# Altium project Pulser_Driver.PrjPcb
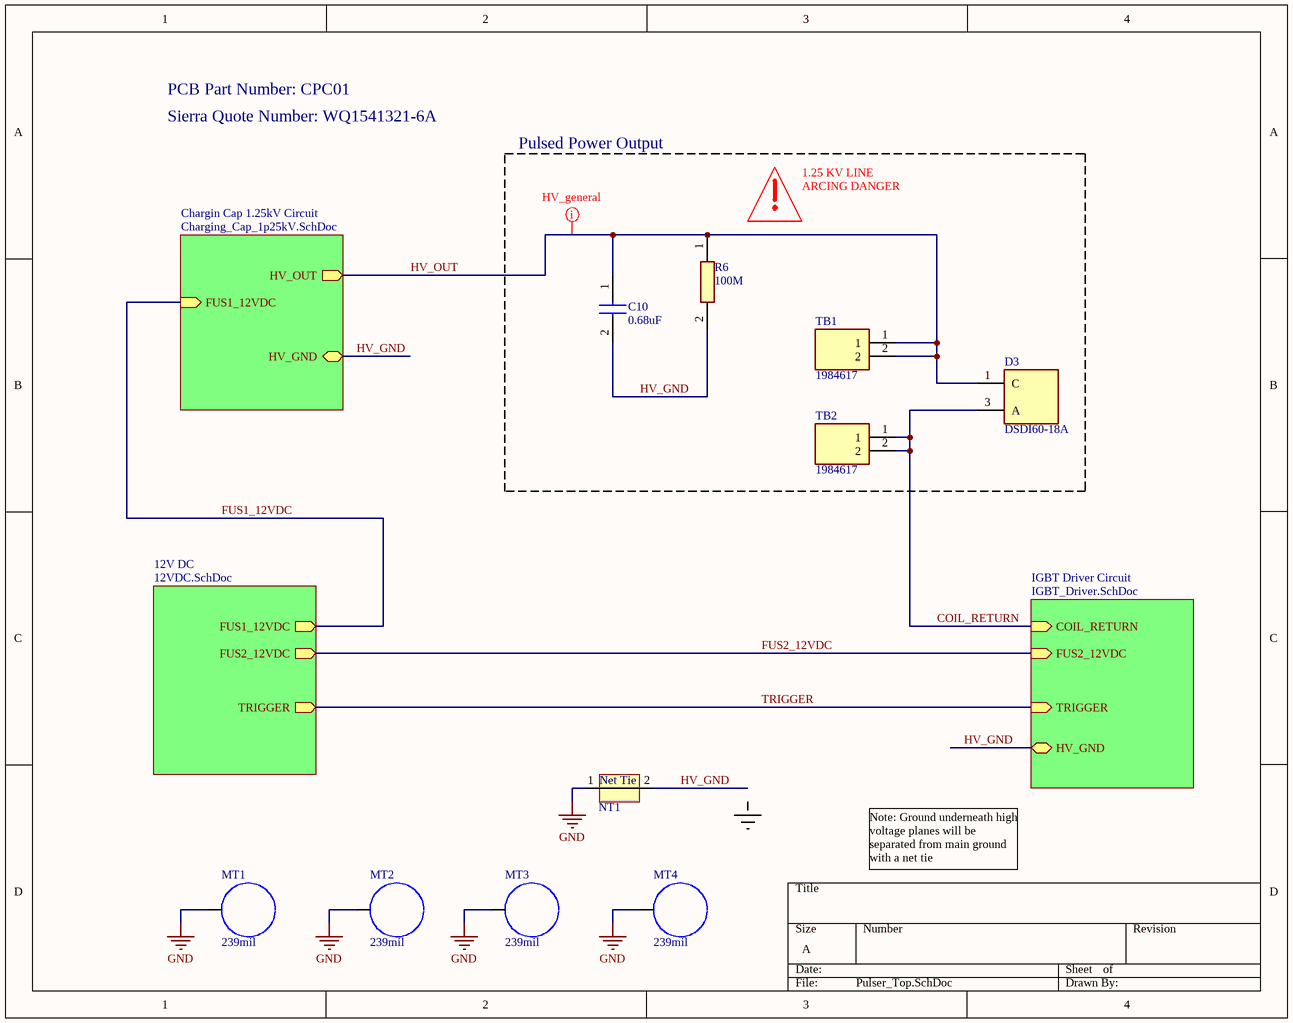
[diagram p0: Pulser_Top.SchDoc]
4 sheets, 49 parts. Net scope: hierarchical (ports join the sheet entries above them; power ports are global).
Board file: Pulser_Driver_PCB.PcbDoc
Sheets:
  Pulser_Top.SchDoc
    Chargin Cap 1.25kV Circuit = Charging_Cap_1p25kV.SchDoc
    12V DC = 12VDC.SchDoc
    IGBT Driver Circuit = IGBT_Driver.SchDoc

## Sheet Pulser_Top.SchDoc
size A; SheetNumber: 1; SheetTotal: 4

### Parts
C10  0.68uF  [MKP1839468134HQ]
D3  DSDI60-18A  [TO546P530X1586X2594-2P]
MT1  239mil  [MTHOLE_239mil]
MT2  239mil  [MTHOLE_239mil]
MT3  239mil  [MTHOLE_239mil]
MT4  239mil  [MTHOLE_239mil]
NT1  Net tie 50mil  [NET_TIE_50mil]  (value not drawn)  (net tie, no BOM)
R6  100M  [HB3100MFZRE]
TB1  1984617  [1984617]
TB2  1984617  [1984617]

### Blocks framed on the sheet
Pulsed Power Output: C10 D3 R6 TB1 TB2

### Sub-sheets
12V DC = 12VDC.SchDoc: TRIGGER (out), FUS2_12VDC (out), FUS1_12VDC (out)
Chargin Cap 1.25kV Circuit = Charging_Cap_1p25kV.SchDoc: HV_OUT (out), FUS1_12VDC (in), HV_GND (bidir)
IGBT Driver Circuit = IGBT_Driver.SchDoc: COIL_RETURN (in), TRIGGER (in), FUS2_12VDC (in), HV_GND (bidir)

### Nets
GND: MT1.1 MT2.1 MT3.1 MT4.1 NT1.1
COIL_RETURN: D3.3(A) TB2.1 TB2.2 ; sheet IGBT Driver Circuit/COIL_RETURN
FUS1_12VDC: sheet Chargin Cap 1.25kV Circuit/FUS1_12VDC, sheet 12V DC/FUS1_12VDC
FUS2_12VDC: sheet 12V DC/FUS2_12VDC, sheet IGBT Driver Circuit/FUS2_12VDC
HV_GND: C10.2 NT1.2 R6.2 ; sheet Chargin Cap 1.25kV Circuit/HV_GND, sheet IGBT Driver Circuit/HV_GND
HV_OUT: C10.1 D3.1(C) R6.1 TB1.1 TB1.2 ; sheet Chargin Cap 1.25kV Circuit/HV_OUT
TRIGGER: sheet 12V DC/TRIGGER, sheet IGBT Driver Circuit/TRIGGER

### Layout directives
net class HV_general: HV_OUT

### Notes on the sheet
- PCB Part Number: CPC01
- Sierra Quote Number: WQ1541321-6A
- 1.25 KV LINE
- ARCING DANGER
- Note: Ground underneath high voltage planes will be separated from main ground with a net tie
- (in symbol NET_TIE_50mil) Net Tie

### Library data of the parts
C10 = MKP1839468134HQ: Capacitor MKP1839468134HQ; Manufacturer_Name: Vishay; Datasheet Link: https://www.vishay.com/docs/28162/mkp1839hq.pdf; Height: 28mm; Manufacturer_Part_Number: MKP1839468134HQ; Mouser Part Number: 75-MKP1839468134HQ; Mouser Price/Stock: https://www.mouser.com/Search/Refine.aspx?Keyword=75-MKP1839468134HQ
D3 = DSDI60-18A: Diode; Manufacturer_Name: LITTELFUSE; Datasheet Link: http://ixapps.ixys.com/DataSheet/96517.pdf; Height: 5.3mm; Manufacturer_Part_Number: DSDI60-18A
MT1-MT4 = MTHOLE_239MIL: Manufacturer Part Number: (NULL); Part Number: MTHOLE_239; Manufacturer: (NULL)
NT1 = NET_TIE_50mil
R6 = HB3100MFZRE: Resistor; Manufacturer_Name: TE Connectivity; Datasheet Link: http://www.te.com/commerce/DocumentDelivery/DDEController?Action=srchrtrv&DocNm=1773310&DocType=DS&DocLang=English; Manufacturer_Part_Number: HB3100MFZRE
TB1 TB2 = 1984617: Connector; Manufacturer_Name: Phoenix Contact; Datasheet Link: https://datasheet.datasheetarchive.com/originals/distributors/Datasheets-DGA17/1074867.pdf; Height: 9.3mm; Manufacturer_Part_Number: 1984617; Mouser Part Number: 651-1984617; Mouser Price/Stock: https://www.mouser.co.uk/ProductDetail/Phoenix-Contact/1984617?qs=ATjOrvm3mOhUrGlJQoUcpQ%3D%3D; Arrow Part Number: 1984617; Arrow Price/Stock: https://www.arrow.com/en/products/1984617/phoenix-contact?region=nac

## Sheet Charging_Cap_1p25kV.SchDoc
size A; SheetNumber: 4; SheetTotal: 4
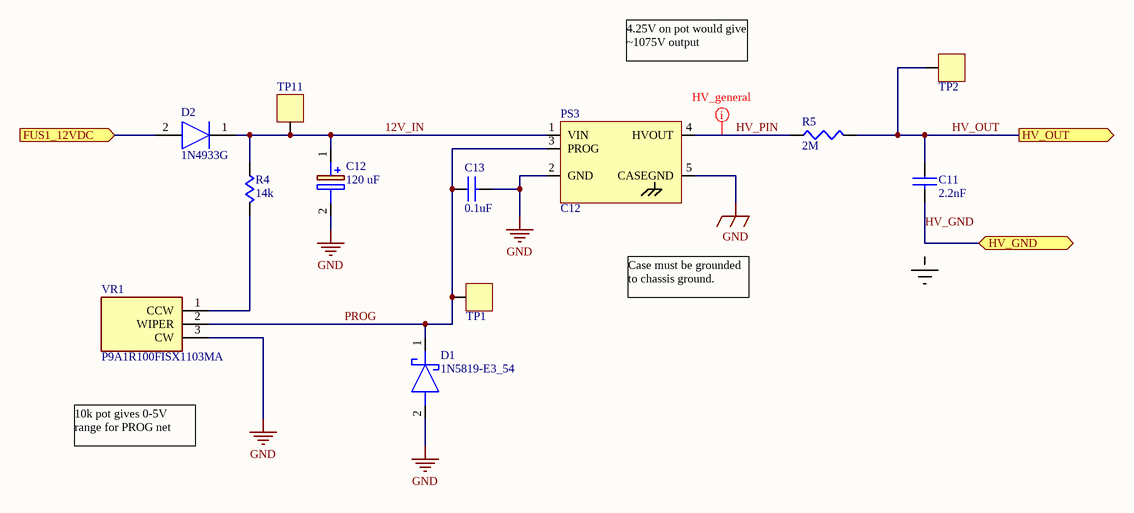
[diagram p1: Charging_Cap_1p25kV.SchDoc]

### Parts
C11  2.2nF  [C331C222KHR5HA]
C12  120 uF  [CAPPRD500W65D1000H1400]
C13  0.1uF  [C420C104K5R5TA7200]
D1  1N5819-E3_54  [DIOAD1405W86L465D235]
D2  1N4933G  [DIOAD1405W86L465D235]
PS3  C12  [C12]
R4  14k  [MFR-25FBF52-14K]
R5  2M  [HHV1WSJT-73-2M]
TP1  5261  [5261]  (value not drawn)
TP2  5261  [5261]  (value not drawn)
TP11  5261  [5261]  (value not drawn)
VR1  P9A1R100FISX1103MA  [P9A1R100FISX1103MA]

### Ports
FUS1_12VDC (in), HV_GND (bidir), HV_OUT (out)

### Nets
GND: C12.2(-) C13.2 D1.2(A) PS3.2(GND) PS3.5(CASEGND) VR1.3(CW)
12V_IN: C12.1(+) D2.1(K) PS3.1(VIN) R4.1 TP11.1
FUS1_12VDC: D2.2(A) ; port FUS1_12VDC
HV_GND: C11.2 ; port HV_GND
HV_OUT: C11.1 R5.2 TP2.1 ; port HV_OUT
HV_PIN: PS3.4(HVOUT) R5.1
PROG: C13.1 D1.1(K) PS3.3(PROG) TP1.1 VR1.2(WIPER)
NetR4_2: R4.2 VR1.1(CCW)

### Layout directives
net class HV_general: HV_PIN

### Notes on the sheet
- 4.25V on pot would give ~1075V output
- Case must be grounded to chassis ground.
- 10k pot gives 0-5V range for PROG net

### Library data of the parts
C11 = C331C222KHR5HA: Multilayer Ceramic Capacitors MLCC - Leaded 3000V 2200pF X7R 10% LS=6.35mm
C12 = EEU-TP1V121: Capacitor Polarised; Manufacturer_Name: Panasonic; Datasheet Link: http://industrial.panasonic.com/cdbs/www-data/pdf/RDF0000/ABA0000C1134.pdf; Height: 14mm; Manufacturer_Part_Number: EEU-TP1V121
C13 = C420C104K5R5TA7200: CAP CER TH 0.1UF 50V X7R AXIAL
D1 = 1N5819-E3_54: Schottky Diode; Manufacturer_Name: Vishay; Manufacturer_Part_Number: 1N5819-E3/54; Datasheet Link: https://www.vishay.com/docs/88525/1n5817.pdf; Mouser Part Number: 625-1N5819-E3; Mouser Price/Stock: https://www.mouser.co.uk/ProductDetail/Vishay-General-Semiconductor/1N5819-E3-54?qs=7w0fSgRKp93guDuu%252B5hJ0Q%3D%3D
D2 = 1N4933G: Rectifiers 50V 1A Fast; Manufacturer_Name: ON Semiconductor; Datasheet Link: https://www.arrow.com/en/products/1n4933g/on-semiconductor; Manufacturer_Part_Number: 1N4933G; Mouser Part Number: 863-1N4933G; Mouser Price/Stock: https://www.mouser.co.uk/ProductDetail/onsemi/1N4933G?qs=y2kkmE52mdNCdpmhcWNRQA%3D%3D; Arrow Part Number: 1N4933G; Arrow Price/Stock: https://www.arrow.com/en/products/1n4933g/on-semiconductor?region=nac
PS3 = C12: MPN is C12, DC DC conv
R4 = MFR-25FBF52-14K: RES TH 14K OHM 1% 1/4W AXIAL
R5 = HHV1WSJT-73-2M: RES 2M OHM 5% 1W AXIAL
TP1 TP2 TP11 = 5261: TEST POINT grabber (BLACK) - MINIATURE
VR1 = P9A1R100FISX1103MA: Variable Resistor 10K; Manufacturer_Name: Vishay; Datasheet Link: https://www.mouser.com/datasheet/2/427/p9-1763422.pdf; Height: 11.35mm; Manufacturer_Part_Number: P9A1R100FISX1103MA; Mouser Part Number: 72-P9A1RFISX1BB2103M; Mouser Price/Stock: https://www.mouser.com/Search/Refine.aspx?Keyword=72-P9A1RFISX1BB2103M

## Sheet 12VDC.SchDoc
size A; SheetNumber: 3; SheetTotal: 4
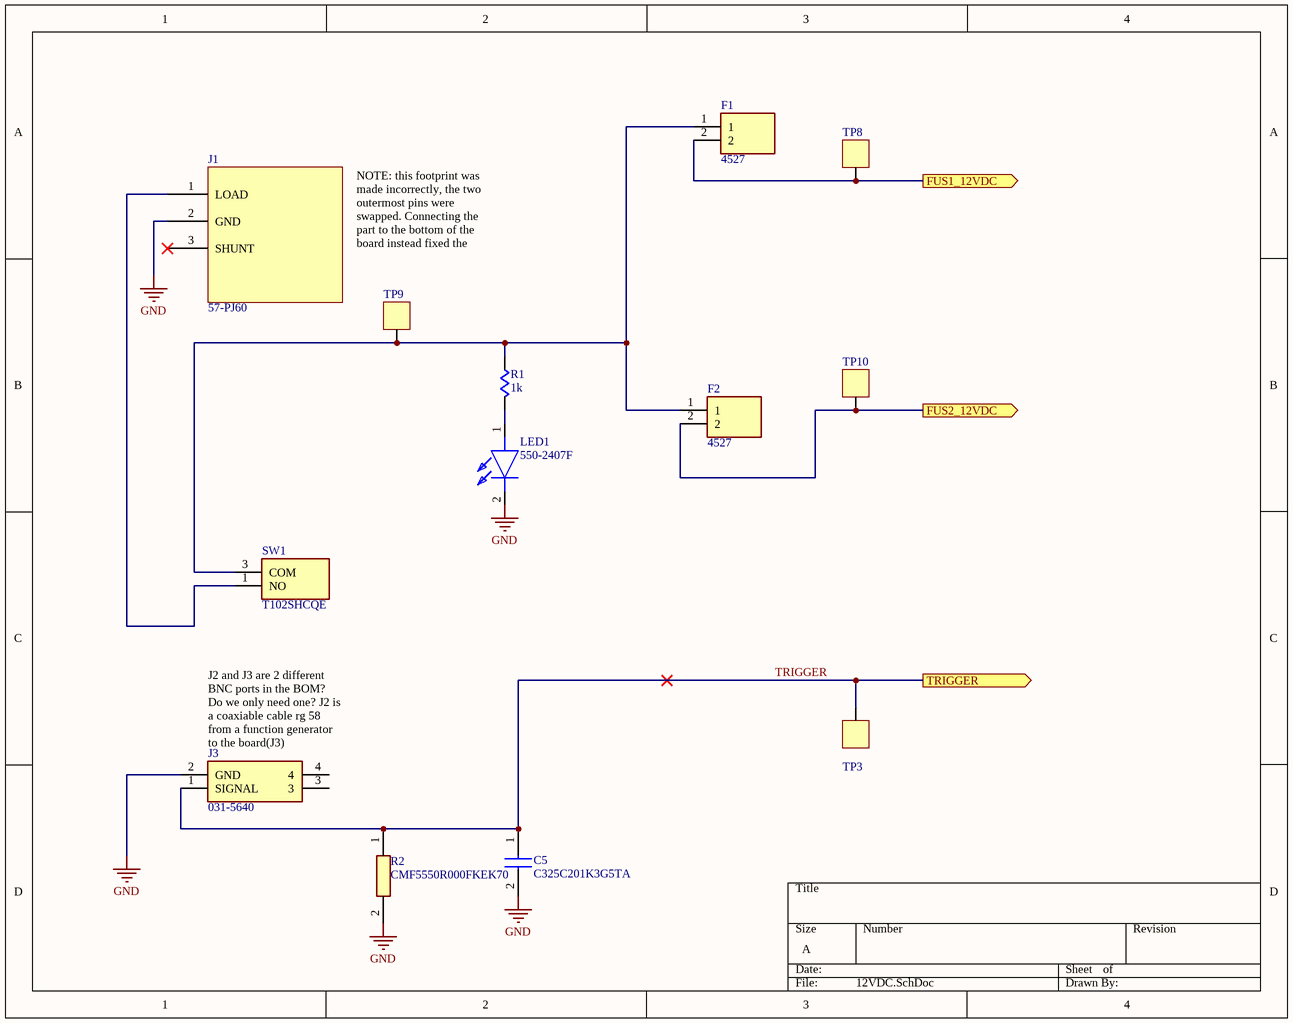
[diagram p2: 12VDC.SchDoc]

### Parts
C5  C325C201K3G5TA  [C325C201K3G5TA]
F1  4527  [4527]
F2  4527  [4527]
J1  57-PJ60  [57-PJ60]
J3  031-5640  [031-5640]
LED1  550-2407F  [5502407F]
R1  1k  [CMF551K0000FKR6]
R2  CMF5550R000FKEK70  [RESAD1526W69L610D229]
SW1  T102SHCQE  [T102SHCQE]
TP3  5261  [5261]  (value not drawn)
TP8  5261  [5261]  (value not drawn)
TP9  5261  [5261]  (value not drawn)
TP10  5261  [5261]  (value not drawn)

### Ports
FUS1_12VDC (out), FUS2_12VDC (out), TRIGGER (out)

### Nets
GND: C5.2 J1.2(GND) J3.2(GND) LED1.2(K) R2.2
FUS1_12VDC: F1.2 TP8.1 ; port FUS1_12VDC
FUS2_12VDC: F2.2 TP10.1 ; port FUS2_12VDC
TRIGGER: C5.1 J3.1(SIGNAL) R2.1 TP3.1 ; port TRIGGER
NetF1_1: F1.1 F2.1 R1.1 SW1.3(COM) TP9.1
NetJ1_1: J1.1(LOAD) SW1.1(NO)
NetLED1_1: LED1.1(A) R1.2

Not connected (* = marked no-connect by the designer): J1 3(SHUNT)*; J3 3 4

### Notes on the sheet
- NOTE: this footprint was made incorrectly, the two outermost pins were swapped. Connecting the part to the bottom of the board instead fixed the issue in hardware.
- (near J3) J2 and J3 are 2 different BNC ports in the BOM? Do we only need one? J2 is a coaxiable cable rg 58 from a function generator to the board(J3)

### Library data of the parts
C5 = C325C201K3G5TA: Capacitor 200 pF; Manufacturer_Name: Kemet; Datasheet Link: https://www.kemet.com/specsheet/C325C201K3G5TA; Height: 7.62mm; Manufacturer_Part_Number: C325C201K3G5TA
F1 F2 = 4527: Undefined or Miscellaneous; Manufacturer_Name: Keystone Electronics; Datasheet Link: https://componentsearchengine.com//4527.pdf; Mouser2 Part Number: 534-4527; Mouser2 Price/Stock: https://www.mouser.com/Search/Refine.aspx?Keyword=534-4527; Manufacturer_Part_Number: 4527
J3 = 031-5640: Connector; Manufacturer_Name: Amphenol; Manufacturer_Part_Number: 031-5640-1010; Datasheet Link: https://datasheet.datasheetarchive.com/originals/distributors/Datasheets_SAMA/570beec7961c44031375f59c7939d09c.pdf; Height: 15.9mm
LED1 = 550-2407F: LED; Manufacturer_Name: Dialight; Datasheet Link: https://componentsearchengine.com//550-2407F.pdf; Height: 6.1mm; Mouser2 Part Number: 645-550-2407F; Mouser2 Price/Stock: https://www.mouser.com/Search/Refine.aspx?Keyword=645-550-2407F; Manufacturer_Part_Number: 550-2407F
R1 = CMF551K0000FKR6: Metal Film Resistors - Through Hole 1/2W 1Kohms 1%
R2 = CMF5550R000FKEK70: Resistor 50ohm; Manufacturer_Name: Vishay; Datasheet Link: http://www.vishay.com/docs/31018/cmfind.pdf; Manufacturer_Part_Number: CMF5550R000FKEK70
SW1 = T102SHCQE: Switch; Manufacturer_Name: C & K COMPONENTS; Datasheet Link: https://componentsearchengine.com/Datasheets/1/T102SHCQE.pdf; Height: 23.56mm; Manufacturer_Part_Number: T102SHCQE
TP3 TP8-TP10 = 5261: TEST POINT grabber (BLACK) - MINIATURE

## Sheet IGBT_Driver.SchDoc
size A; SheetNumber: 2; SheetTotal: 4
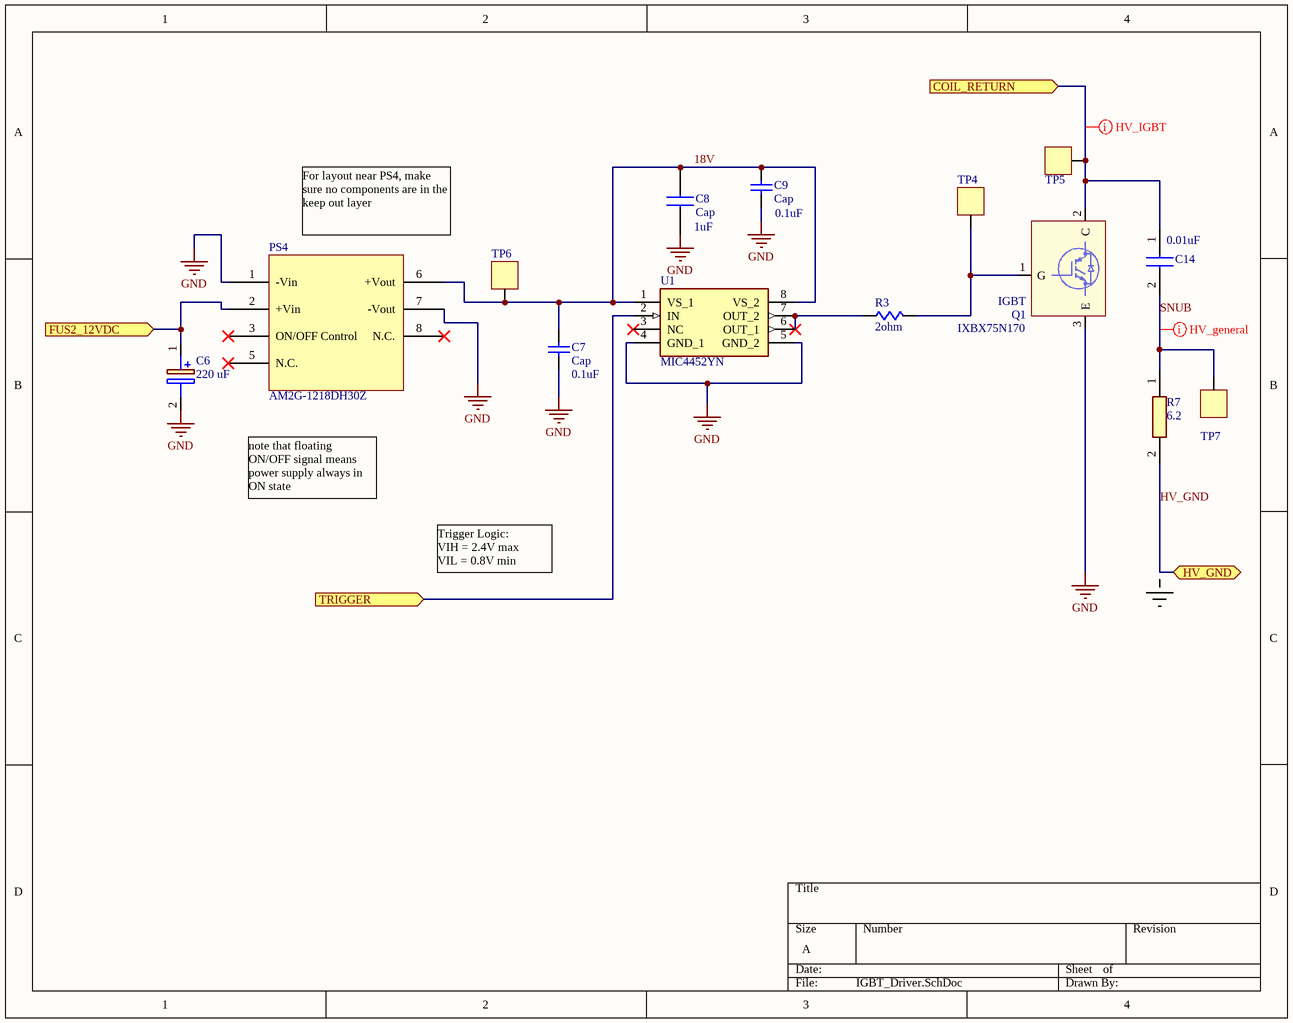
[diagram p3: IGBT_Driver.SchDoc]

### Parts
C6  220 uF  [CAPPRD750W85D1600H2700]
C7  Cap  value 0.1uF  [RAD-0.3]
C8  Cap  [MKS2D041001K00KSSD]
C9  Cap  value 0.1uF  [RAD-0.3]
C14  0.01uF  [FKP1U021006B00MSC9]
PS4  AM2G-1218DH30Z  [AM2G-1218DH30Z]
Q1  IXBX75N170  [TO545P521X1594X2566-3P]
R3  2ohm  [F2W2D0]
R7  6.2  [RESAD1700W60L700D250]
TP4  5261  [5261]  (value not drawn)
TP5  5261  [5261]  (value not drawn)
TP6  5261  [5261]  (value not drawn)
TP7  5261  [5261]  (value not drawn)
U1  MIC4452YN  [DIP762W57P254L952H343Q8N]

### Ports
COIL_RETURN (in), FUS2_12VDC (in), HV_GND (bidir), TRIGGER (in)

### Nets
GND: C6.2(-) C7.1 C8.2 C9.1 PS4.1(-Vin) PS4.7(-Vout) Q1.3(E) U1.4(GND_1) U1.5(GND_2)
18V: C7.2 C8.1 C9.2 PS4.6(+Vout) TP6.1 U1.1(VS_1) U1.8(VS_2)
COIL_RETURN: C14.1 Q1.2(C) TP5.1 ; port COIL_RETURN
FUS2_12VDC: C6.1(+) PS4.2(+Vin) ; port FUS2_12VDC
HV_GND: R7.2 ; port HV_GND
SNUB: C14.2 R7.1 TP7.1
TRIGGER: U1.2(IN) ; port TRIGGER
NetQ1_1: Q1.1(G) R3.2 TP4.1
NetR3_1: R3.1 U1.6(OUT_1) U1.7(OUT_2)

Not connected (* = marked no-connect by the designer): PS4 3(ON/OFF_Control)* 5(N.C.)* 8(N.C.)*; U1 3(NC)*

### Layout directives
net class HV_general: SNUB
net class HV_IGBT: COIL_RETURN

### Notes on the sheet
- (near PS4) For layout near PS4, make sure no components are in the keep out layer
- (near C8) 1uF
- note that floating ON/OFF signal means power supply always in ON state
- Trigger Logic:
  VIH = 2.4V max
  VIL = 0.8V min
- (in symbol IXBX75N170) IGBT

### Library data of the parts
C6 = EEU-FS2A221B: Capacitor Polarised 100VDC 220uF 1800mA EEU-FS2A221B; Manufacturer_Name: Panasonic; Datasheet Link: http://industrial.panasonic.com/cdbs/www-data/pdf/RDF0000/ABA0000C1255.pdf; Height: 27mm; Manufacturer_Part_Number: EEU-FS2A221B; Mouser Part Number: 667-EEU-FS2A221B; Mouser Price/Stock: https://www.mouser.co.uk/ProductDetail/Panasonic/EEU-FS2A221B?qs=w%2Fv1CP2dgqqAbg7G%252BWfZEw%3D%3D; Arrow Part Number: EEU-FS2A221B; Arrow Price/Stock: https://www.arrow.com/en/products/eeu-fs2a221b/panasonic
C7 = Cap: Capacitor 0.1 µF ±10% 100V Ceramic Capacitor X7R Axial SA301C104KAA; Published: 8-Jun-2000; LatestRevisionDate: 17-Jul-2002; LatestRevisionNote: Re-released for DXP Platform.; PackageReference: RAD-0.3; Publisher: Altium Limited; PackageDescription: Radial Cap, Thru-Hole; 2 Leads; 0.3 in Pin Spacing
C8 = MKS2D041001K00KSSD: Capacitor; Manufacturer_Name: WIMA; Datasheet Link: https://componentsearchengine.com/Datasheets/2/MKS2D041001K00KSSD.pdf; Height: 13mm; Manufacturer_Part_Number: MKS2D041001K00KSSD
C9 = Cap: Capacitor Capacitor 0.1 µF ±10% 100V Ceramic Capacitor X7R Axial SA301C104KAA; Published: 8-Jun-2000; LatestRevisionDate: 17-Jul-2002; LatestRevisionNote: Re-released for DXP Platform.; PackageReference: RAD-0.3; Publisher: Altium Limited; PackageDescription: Radial Cap, Thru-Hole; 2 Leads; 0.3 in Pin Spacing
C14 = FKP1U021006B00MSC9: Capacitor; Manufacturer_Name: WIMA; Datasheet Link: https://www.mouser.com/datasheet/2/440/e_WIMA_FKP_1-1139839.pdf; Height: 21mm; Manufacturer_Part_Number: FKP1U021006B00MSC9
Q1 = IXBX75N170: Transistor IGBT; Manufacturer_Name: IXYS SEMICONDUCTOR; Datasheet Link: https://www.littelfuse.com/~/media/electronics/datasheets/discrete_igbts/littelfuse_discrete_igbts_bimosfet_ixb_75n170_datasheet.pdf.pdf; Height: 5.21mm; Manufacturer_Part_Number: IXBX75N170; Mouser Part Number: 747-IXBX75N170; Mouser Price/Stock: https://www.mouser.co.uk/ProductDetail/IXYS/IXBX75N170?qs=6UKyFUzHTllWMFJjywXaHA%3D%3D
R3 = F2W2D0: RES TH 2 OHM 5% 2W AXIAL
R7 = OD62GJE: Resistor; Manufacturer_Name: Ohmite; Datasheet Link: https://www.ohmite.com/assets/docs/res_od_of_oa.pdf; Manufacturer_Part_Number: OD62GJE
TP4-TP7 = 5261: TEST POINT grabber (BLACK) - MINIATURE

## Nets that join several sheets
GND: Pulser_Top (5 pins), Charging_Cap_1p25kV (6 pins), 12VDC (5 pins), IGBT_Driver (9 pins)
COIL_RETURN: Pulser_Top (D3.3 TB2.1 TB2.2), IGBT_Driver (C14.1 Q1.2 TP5.1)
FUS1_12VDC: Charging_Cap_1p25kV (D2.2), 12VDC (F1.2 TP8.1)
FUS2_12VDC: 12VDC (F2.2 TP10.1), IGBT_Driver (C6.1 PS4.2)
HV_GND: Pulser_Top (C10.2 NT1.2 R6.2), Charging_Cap_1p25kV (C11.2), IGBT_Driver (R7.2)
HV_OUT: Pulser_Top (5 pins), Charging_Cap_1p25kV (C11.1 R5.2 TP2.1)
TRIGGER: 12VDC (C5.1 J3.1 R2.1 TP3.1), IGBT_Driver (U1.2)